# Altium schematic sheet Power_circuit.SchDoc
size A4; SheetNumber: 2; SheetTotal: 5
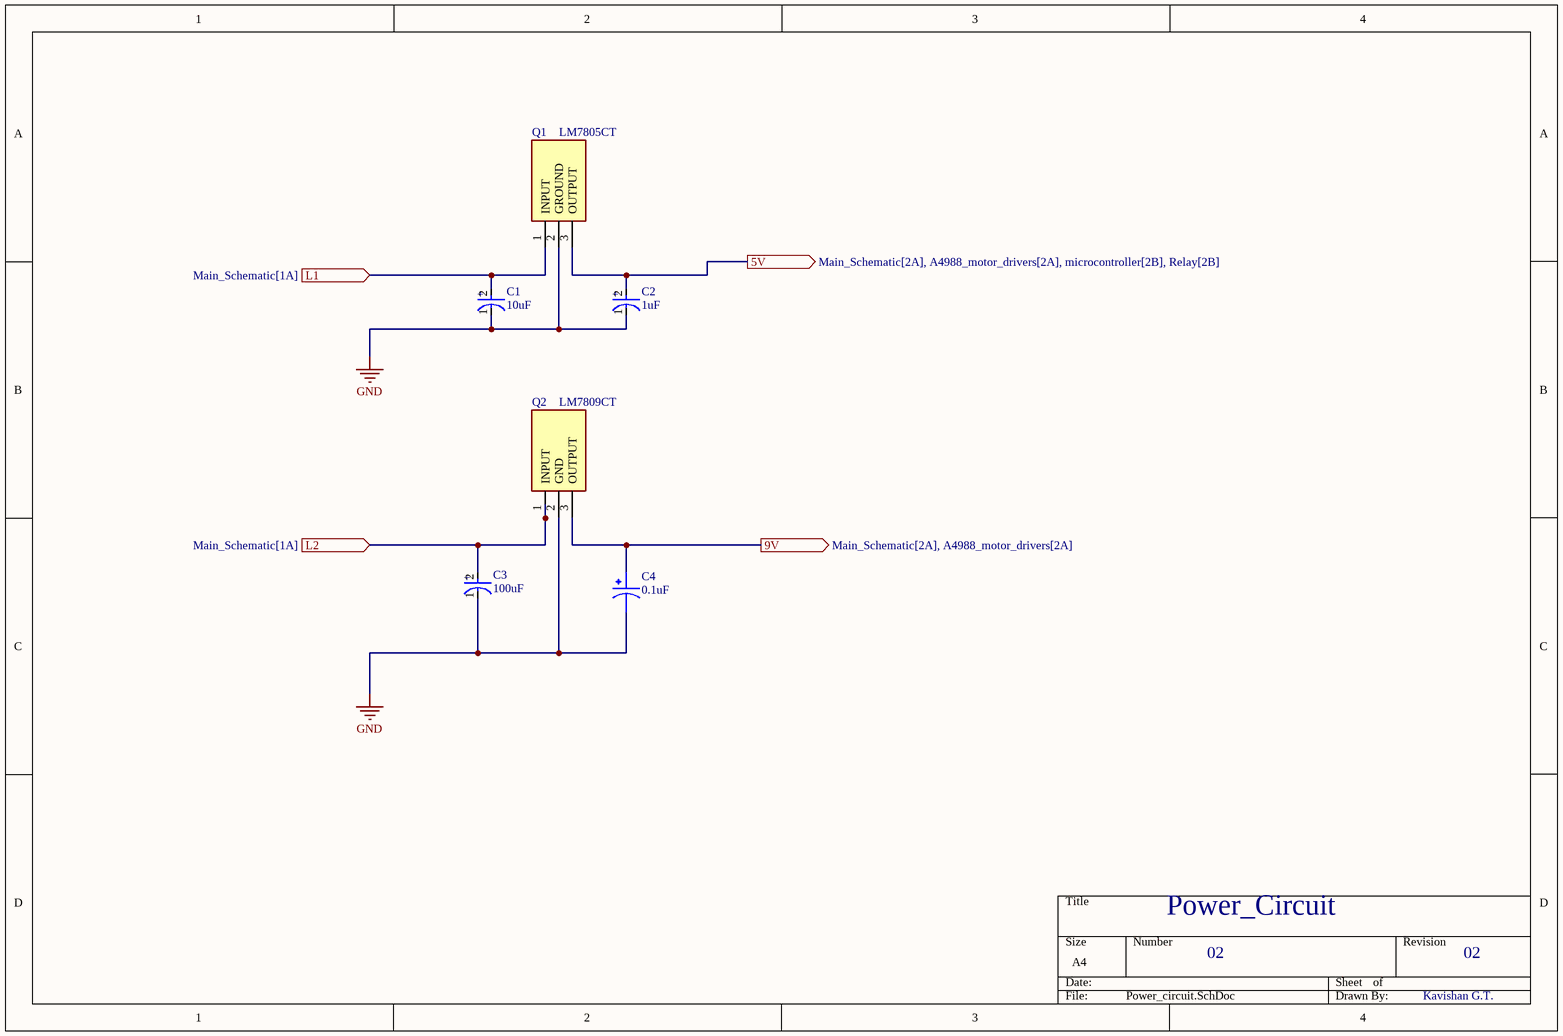
[diagram p0: Power_circuit.SchDoc]

## Parts
C1  10uF  [FP-RAD-TH-D_12_5_0_5-L_20-MFG]
C2  1uF  [FP-ECA-2CHG010I-MFG]
C3  100uF  [FP-RAD-TH-D_6_3_0_5-L_7_1-MFG]
C4  0.1uF  [CAPPRD200W50D550H1250]
Q1  LM7805CT  [TO254P470X1028X1955-3P]
Q2  LM7809CT  [TO254P470X1016X2019-3P]

## Ports
5V (out, see Main_Schematic[2A], A4988_motor_drivers[2A], microcontroller[2B], Relay[2B]), 9V (out, see Main_Schematic[2A], A4988_motor_drivers[2A]), L1 (in, see Main_Schematic[1A]), L2 (in, see Main_Schematic[1A])

## Nets
GND: C1.1(C) C2.1(C) C3.1(C) C4.2 Q1.2(GROUND) Q2.2(GND)
5V: C2.2(A) Q1.3(OUTPUT) ; port 5V
9V: C4.1 Q2.3(OUTPUT) ; port 9V
L1: C1.2(A) Q1.1(INPUT) ; port L1
L2: C3.2(A) Q2.1(INPUT) ; port L2

## Notes on the sheet
- Power_Circuit
- 02
- Kavishan G.T.
- (in symbol CMP-05427-000861-1) +
- (in symbol CMP-05427-001316-1) +
- (in symbol CMP-05427-002176-1) +

## Library data of the parts
C1 = CMP-05427-000861-1: Aluminum Electrolytic Capacitors (Radial Lead Type) 10uF ±20% 450V; Polarity: Polar; Ripple Current (AC): 350mA; Life (Hours): 10000Hour; Lead Diameter: 0.6mm; Dielectric Material: Aluminium; Dissipation Factor: 0.24%; Voltage Rating: 450V; Lead Free: Lead Free; Capacitance: 10uF; Length: 20mm; Voltage Rating (DC): 450V; Packaging: Bulk; RoHS Compliant: Yes; Voltage: 450V; Height - Seated (Max): 0.787inch; Max Operating Temperature: 105°C; Lead Pitch: 5mm; Termination: Radial; Contact Plating: Tin; Mount: Through Hole; Diameter: 12.5mm; Number of Pins: 2; Min Operating Temperature: -25°C; Series: ED; Package Quantity: 200; Tolerance: 20%; REACH SVHC: No SVHC; Ripple Current: 350mA; Construction: RADIAL; Height: 20mm; Radiation Hardening: No; Case/Package: Radial
C2 = CMP-05427-002176-1: CAP ALUM 1UF 20% 160V RADIAL; Lead/Base Style: Straight; Ripple Current: 17mA; Life (Hours): 2000Hour; Voltage Rating (DC): 160V; Max Operating Temperature: 105°C; Radiation Hardening: No; Min Operating Temperature: -25°C; Packaging: Ammo Pack; Series: NHG; Capacitance: 1uF; Height - Seated (Max): 0.48inch; Lead Pitch: 2.5mm; Diameter: 6.3mm; Length: 11.2mm; Package Quantity: 2000; Termination: Radial; RoHS Compliant: Yes; Voltage Rating: 160V; Tolerance: 20%; Height: 11.2mm; Case/Package: Radial; Mount: Through Hole
C3 = CMP-05427-001316-1: Aluminum Electrolytic Capacitors (Radial Lead Type) 100uF ±20% 16V; Life (Hours): 1000Hour; Lead Diameter: 0.45mm; Polarity: Polar; Ripple Current: 91mA; Series: KA; Packaging: Tape and Reel; Voltage Rating: 16V; Voltage Rating (DC): 16V; Min Operating Temperature: -40°C; Lead Pitch: 2.5mm; Mount: Through Hole; Height - Seated (Max): 0.315inch; Package Quantity: 2000; Length: 7mm; Termination: Radial; Voltage: 16V; Diameter: 6.3mm; Height: 7mm; Radiation Hardening: No; RoHS Compliant: Yes; Tolerance: 20%; Capacitance: 100uF; Case/Package: Radial; Max Operating Temperature: 85°C
C4 = UVR1H0R1MDD: 0.1ÂµF 50V Aluminum Electrolytic Capacitors Radial, Can 2000 Hrs @ 85Â°C; MF: Nichicon; Value: *; SnapEDA_Link: https://www.snapeda.com/parts/UVR1H0R1MDD/Nichicon/view-part/1435228/?ref=snap; Price: None; Availability: Warning; DigiKey-Purchase-URL: https://snapeda.com/shop?store=DigiKey&id=1435228; Mouser-Purchase-URL: https://snapeda.com/shop?store=Mouser&id=1435228; Package: Radial Nichicon; MP: UVR1H0R1MDD
Q1 = LM7805CT: Integrated Circuit; Manufacturer_Name: Texas Instruments; Datasheet Link: http://www.ti.com/lit/ds/symlink/lm340.pdf; Height: 4.7mm; Manufacturer_Part_Number: LM7805CT; Mouser Part Number: 926-LM7805CT; Mouser Price/Stock: https://www.mouser.co.uk/ProductDetail/Texas-Instruments/LM7805CT?qs=QbsRYf82W3EaqXeMDVwIfQ%3D%3D; Arrow Part Number: LM7805CT; Arrow Price/Stock: https://www.arrow.com/en/products/lm7805ct/texas-instruments?region=europe
Q2 = LM7809CT: Power Supply; Manufacturer_Name: onsemi; Datasheet Link: https://mouser.componentsearchengine.com/Datasheets/2/LM7809CT.pdf; Height: 4.7mm; Manufacturer_Part_Number: LM7809CT; Mouser Part Number: 512-LM7809CT; Mouser Price/Stock: https://www.mouser.co.uk/ProductDetail/ON-Semiconductor-Fairchild/LM7809CT?qs=VOMQJJE%252BBNmmTueoZonUjQ%3D%3D; Arrow Part Number: LM7809CT; Arrow Price/Stock: https://www.arrow.com/en/products/lm7809ct/on-semiconductor?region=europe